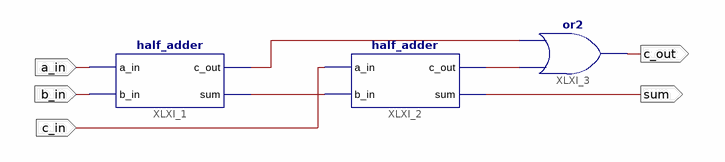
[diagram p0: schematic sheet 1]
// Xilinx ISE schematic one_bit_full_adder.sch (spartan3) as structural Verilog: 3 symbols, 5 ports
module one_bit_full_adder (
  input  c_in,
  input  a_in,
  input  b_in,
  output sum,
  output c_out
);

  wire XLXN_1, XLXN_3, XLXN_4;

  half_adder XLXI_1 (.a_in(a_in), .b_in(b_in), .c_out(XLXN_3), .sum(XLXN_1));
  half_adder XLXI_2 (.a_in(c_in), .b_in(XLXN_1), .c_out(XLXN_4), .sum(sum));
  or XLXI_3 (c_out, XLXN_4, XLXN_3);
endmodule
